# Altium schematic sheet 4-20mA_Inputs_(3-6).SchDoc
size A; SheetNumber: 9; SheetTotal: 16
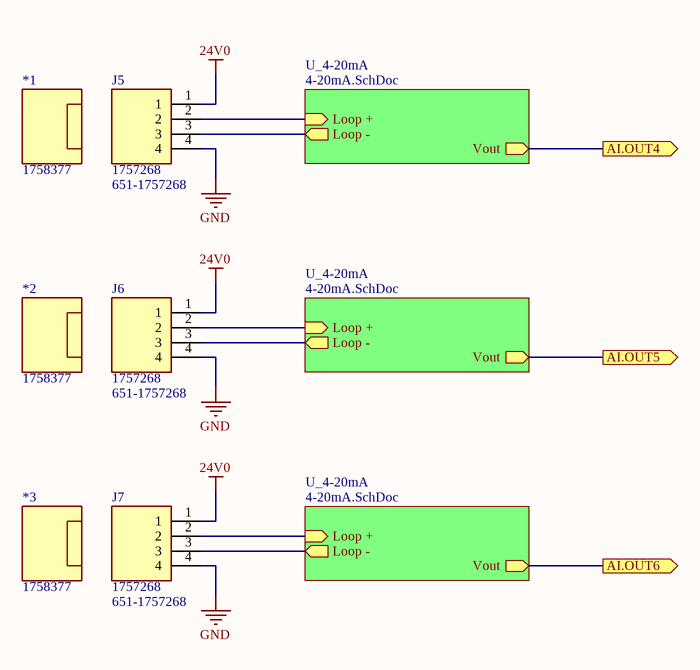
[diagram p0: 4-20mA_Inputs_(3-6).SchDoc]

## Parts
*1  1758377  [Connector_1758377]
*2  1758377  [Connector_1758377]
*3  1758377  [Connector_1758377]
J5  1757268  Supplier Part Number 1: 651-1757268  [SHDRRA4W103P0X508_1X4_2232X1200X875P]
J6  1757268  Supplier Part Number 1: 651-1757268  [SHDRRA4W103P0X508_1X4_2232X1200X875P]
J7  1757268  Supplier Part Number 1: 651-1757268  [SHDRRA4W103P0X508_1X4_2232X1200X875P]

## Sub-sheets
U_4-20mA = 4-20mA.SchDoc: Loop + (in), Loop - (out), Vout (out)
U_4-20mA = 4-20mA.SchDoc: Loop + (in), Loop - (out), Vout (out)
U_4-20mA = 4-20mA.SchDoc: Loop + (in), Loop - (out), Vout (out)

## Ports
AI.OUT4 (out), AI.OUT5 (out), AI.OUT6 (out)

## Nets
24V0: J5.1 J6.1 J7.1
GND: J5.4 J6.4 J7.4
AI.OUT4: port AI.OUT4, sheet U_4-20mA/Vout
AI.OUT5: port AI.OUT5, sheet U_4-20mA/Vout
AI.OUT6: port AI.OUT6, sheet U_4-20mA/Vout
NetJ5_2: J5.2 ; sheet U_4-20mA/Loop +
NetJ5_3: J5.3 ; sheet U_4-20mA/Loop -
NetJ6_2: J6.2 ; sheet U_4-20mA/Loop +
NetJ6_3: J6.3 ; sheet U_4-20mA/Loop -
NetJ7_2: J7.2 ; sheet U_4-20mA/Loop +
NetJ7_3: J7.3 ; sheet U_4-20mA/Loop -

## Library data of the parts
*1-*3 = 1758377: Plug, Terminal Block; 12 A; 250 V; 5.08 mm; 4 position, screw, Pre-Printed; Manufacturer: Phoenix Contact; Voltage Rating: 250V; Max Current Rating: 12A; Number of Positions Per Level: 4; Number of Levels: 1; Current: 15A; Voltage: 300V; Wire Gauge (Max): 30AWG; Wire Gauge (Min): 12AWG; Pitch: 5.08mm; Stripping Length: 7mm; Supplier 1: Digi-Key; Manufacturer Part Number: 1758377; RoHS: Yes; Category: Terminal Blocks; Pricing 1: 1=4.53000, 10=4.33400, 50=4.21580, 100=3.94000, 250=3.62484, 500=3.34900, 1000=3.19143, 2500=3.03380 (USD); Mount: Free Hanging; Color: Green; Contact Plating: Tin; Weight: 0.249387oz; Housing Color: Green; Housing Material: Plastic; Package Quantity: 50; Packaging: Bulk; Current Rating: 12A; Termination: Screw; Number of Positions: 4; Number of Contacts: 4; Number of Poles: 4; Connector Type: Screw; Series: COMBICON MSTB; Flammability Rating: UL94 V-0; ComponentLink1URL: https://datasheet.ciiva.com/795/1758377-795513.pdf?src-supplier=Digi-Key; ComponentLink1Description: https://datasheet.ciiva.com/795/1758377-795513.pdf?src-supplier=Digi-Key; ComponentLink2URL: https://datasheet.ciiva.com/16046/1758377-16046392.pdf?src-supplier=Onlinecomponents.com; ComponentLink2Description: https://datasheet.ciiva.com/16046/1758377-16046392.pdf?src-supplier=Onlinecomponents.com; ComponentLink3URL: https://datasheet.ciiva.com/29376/567557-da-01-de-steckerteil-1758377-50-st-29376878.pdf?src-supplier=Conrad; ComponentLink3Description: https://datasheet.ciiva.com/29376/567557-da-01-de-steckerteil-1758377-50-st-29376878.pdf?src-supplier=Conrad; ComponentLink4URL: https://datasheet.ciiva.com/14607/70055302-14607548.pdf?src-supplier=Allied+Electronics; ComponentLink4Description: https://datasheet.ciiva.com/14607/70055302-14607548.pdf?src-supplier=Allied+Electronics; ComponentLink5URL: https://datasheet.ciiva.com/33106/1758377-33106027.pdf?src-supplier=Today+Components; ComponentLink5Description: https://datasheet.ciiva.com/33106/1758377-33106027.pdf?src-supplier=Today+Components; Supplier Part Number 1: 277-1966-ND; Stock 1: 560
J5-J7 = 1757268: Connector; Manufacturer_Name: Phoenix Contact; Datasheet Link: https://datasheet.datasheetarchive.com/originals/distributors/SFDatasheet-2/sf-00051651.pdf; Height: 8.75mm; Manufacturer_Part_Number: 1757268; Mouser Part Number: 651-1757268; Mouser Price/Stock: https://www.mouser.co.uk/ProductDetail/Phoenix-Contact/1757268?qs=uD%2FdkN7XIa2BicmSj3mD7g%3D%3D; Arrow Part Number: 1757268; Arrow Price/Stock: https://www.arrow.com/en/products/1757268/phoenix-contact?region=nac; Supplier 1: Mouser